# EAGLE design ecohydro-mega-shield (EAGLE 7.4.0)
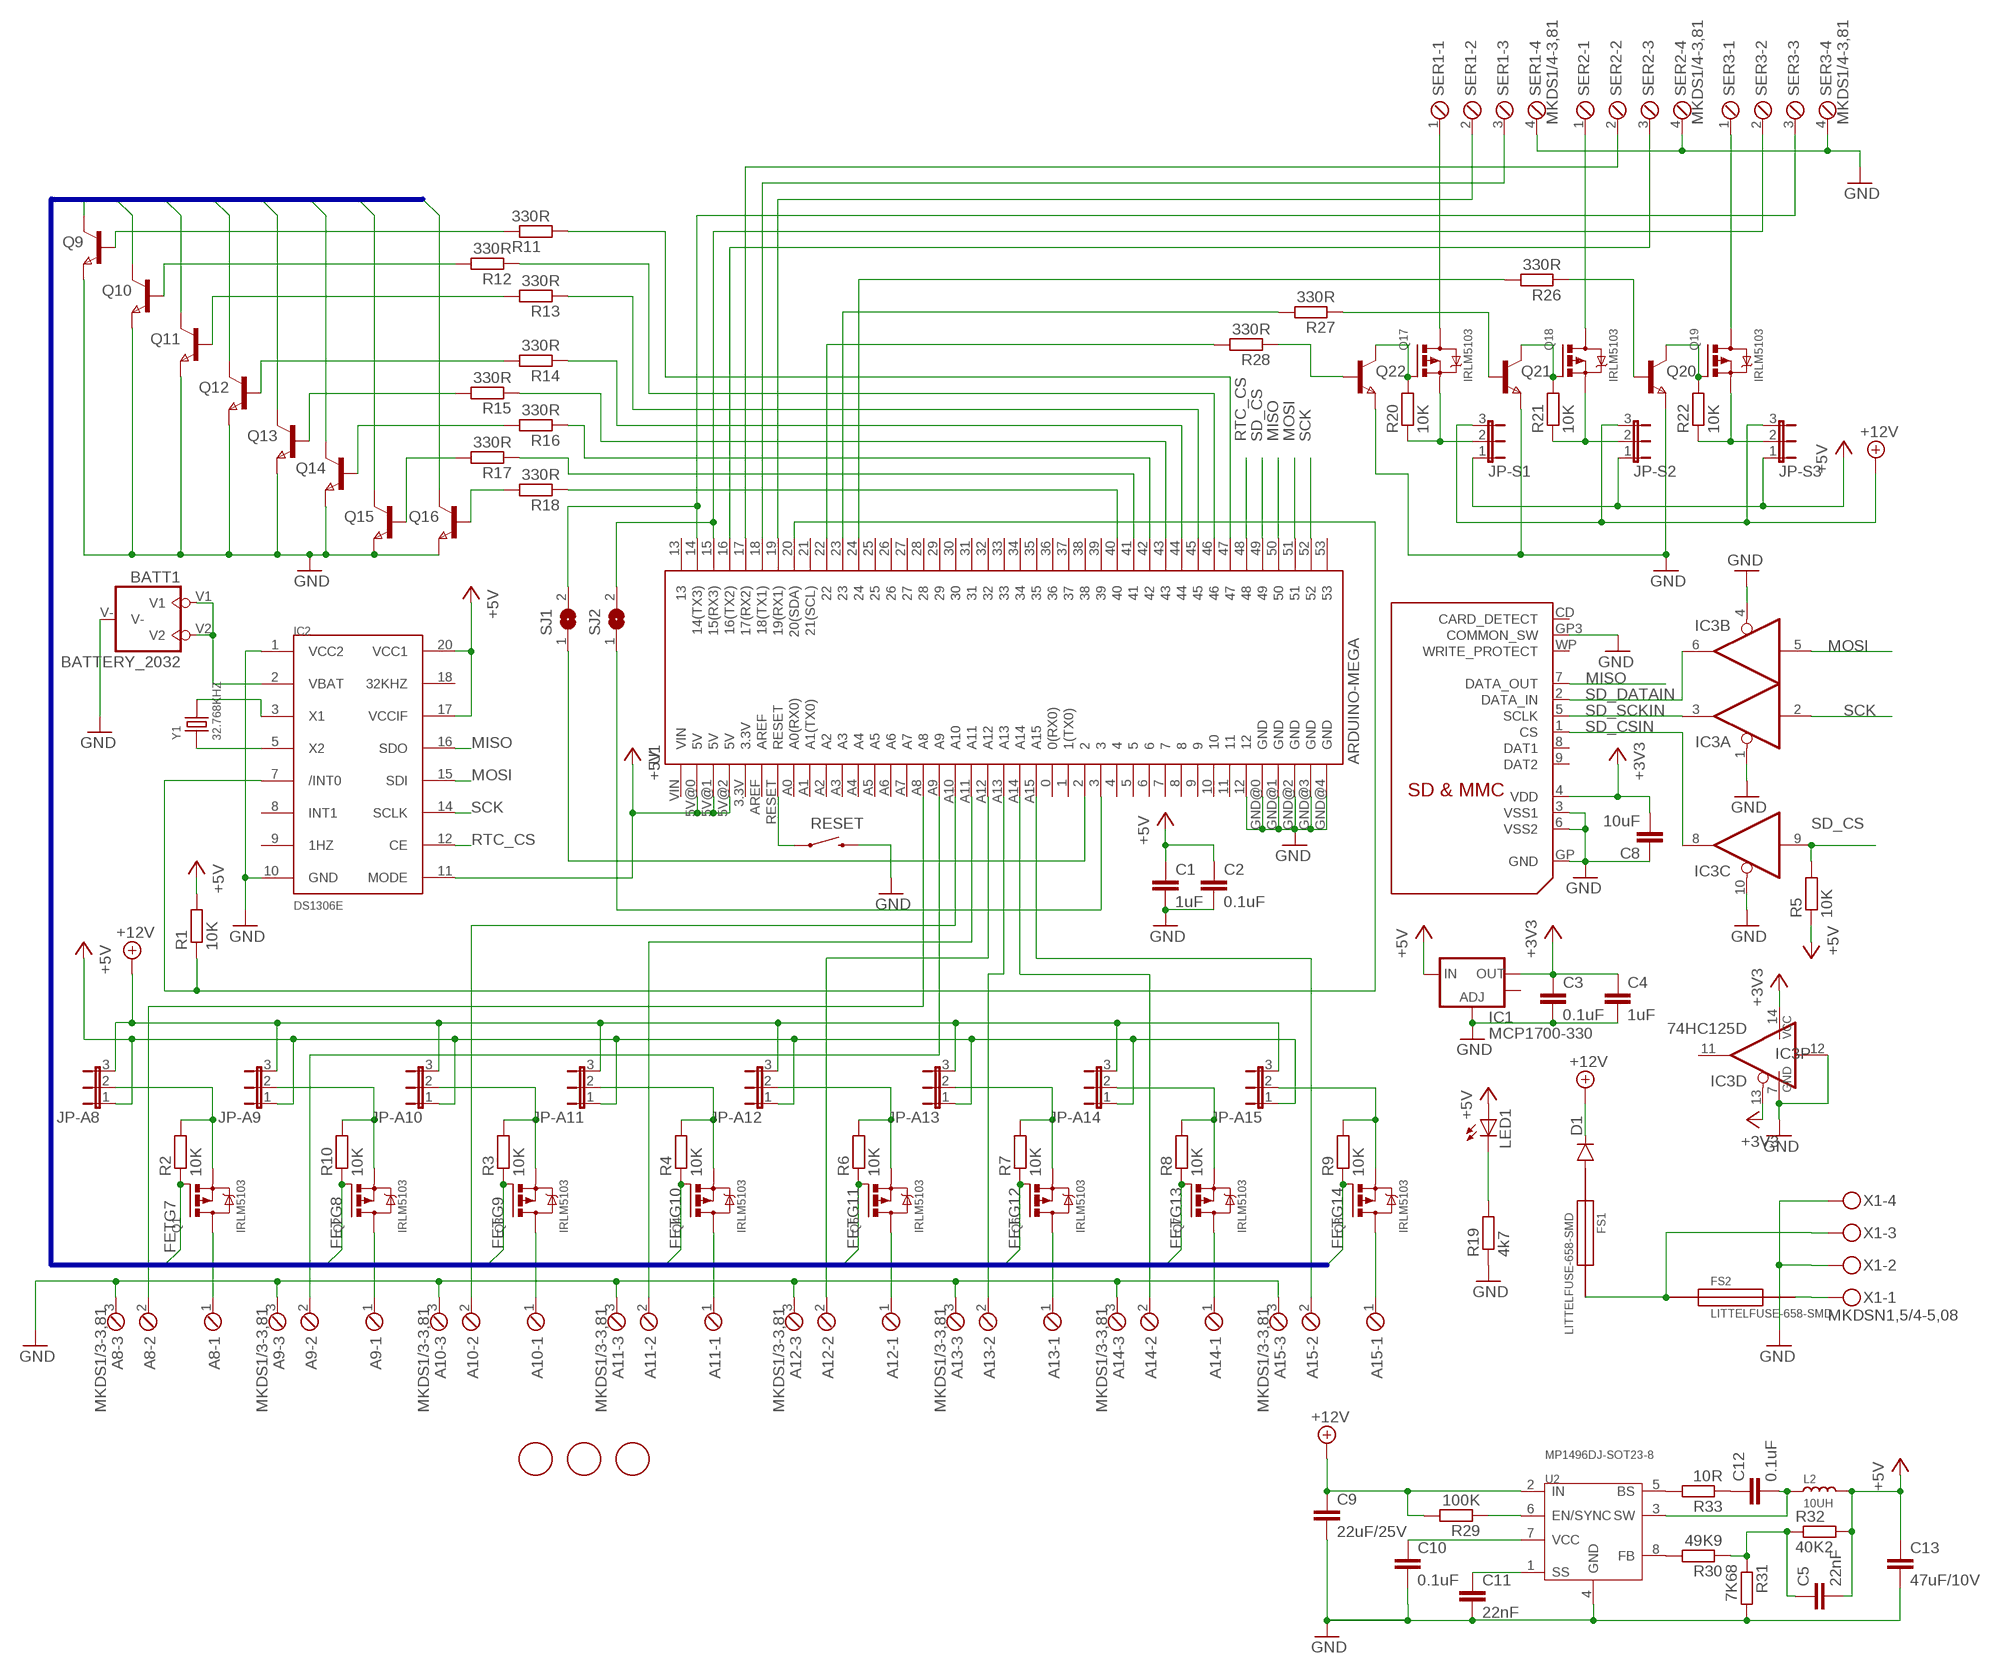
[diagram p0: schematic, sheet 1]

## Parts
A8  MKDS1/3-3,81  [3POL381]
A9  MKDS1/3-3,81  [3POL381]
A10  MKDS1/3-3,81  [3POL381]
A11  MKDS1/3-3,81  [3POL381]
A12  MKDS1/3-3,81  [3POL381]
A13  MKDS1/3-3,81  [3POL381]
A14  MKDS1/3-3,81  [3POL381]
A15  MKDS1/3-3,81  [3POL381]
BATT1  BATTERY_2032  [BATT2032]
C1  1uF  C-EUC0805K  [C0805K]
C2  0.1uF  C-EUC0805K  [C0805K]
C3  0.1uF  C-EUC0805K  [C0805K]
C4  1uF  C-EUC0805K  [C0805K]
C5  22nF  C-EUC0805K  [C0805K]
C8  10uF  C-EUC0805K  [C0805K]
C9  22uF/25V  C-EUC0805K  [C0805K]
C10  0.1uF  C-EUC0805K  [C0805K]
C11  22nF  C-EUC0805K  [C0805K]
C12  0.1uF  C-EUC0805K  [C0805K]
C13  47uF/10V  C-EUC0805K  [C0805K]
D1  DIODESMA  [SMA-DIODE]
FS1  LITTELFUSE-658-SMD  [LITTELFUSE-658-SMD]
FS2  LITTELFUSE-658-SMD  [LITTELFUSE-658-SMD]
IC1  MCP1700-330  V_REG_LM1117SOT223  [SOT223]
IC2  DS1306E  [SSOP20]
IC3  74HC125D  [SO14]
JP-A8  JP2E  [JP2]
JP-A9  JP2E  [JP2]
JP-A10  JP2E  [JP2]
JP-A11  JP2E  [JP2]
JP-A12  JP2E  [JP2]
JP-A13  JP2E  [JP2]
JP-A14  JP2E  [JP2]
JP-A15  JP2E  [JP2]
JP-S1  JP2E  [JP2]
JP-S2  JP2E  [JP2]
JP-S3  JP2E  [JP2]
L2  10UH  SMD-INDUCTOR-10UH-20%(2P-6X6MM)'0630'  [SMD-2P-L6.0XW6.0XH3.0MM]
LED1  LED1206  [LED-1206]
Q1  IRLM5103  [MICRO3]
Q2  IRLM5103  [MICRO3]
Q3  IRLM5103  [MICRO3]
Q4  IRLM5103  [MICRO3]
Q5  IRLM5103  [MICRO3]
Q6  IRLM5103  [MICRO3]
Q7  IRLM5103  [MICRO3]
Q8  IRLM5103  [MICRO3]
Q9  PBSS4021NT,215  [SOT23]
Q10  PBSS4021NT,215  [SOT23]
Q11  PBSS4021NT,215  [SOT23]
Q12  PBSS4021NT,215  [SOT23]
Q13  PBSS4021NT,215  [SOT23]
Q14  PBSS4021NT,215  [SOT23]
Q15  PBSS4021NT,215  [SOT23]
Q16  PBSS4021NT,215  [SOT23]
Q17  IRLM5103  [MICRO3]
Q18  IRLM5103  [MICRO3]
Q19  IRLM5103  [MICRO3]
Q20  PBSS4021NT,215  [SOT23]
Q21  PBSS4021NT,215  [SOT23]
Q22  PBSS4021NT,215  [SOT23]
R1  10K  R-EU_M0805  [M0805]
R2  10K  R-EU_M0805  [M0805]
R3  10K  R-EU_M0805  [M0805]
R4  10K  R-EU_M0805  [M0805]
R5  10K  R-EU_M0805  [M0805]
R6  10K  R-EU_M0805  [M0805]
R7  10K  R-EU_M0805  [M0805]
R8  10K  R-EU_M0805  [M0805]
R9  10K  R-EU_M0805  [M0805]
R10  10K  R-EU_M0805  [M0805]
R11  330R  R-EU_M0805  [M0805]
R12  330R  R-EU_M0805  [M0805]
R13  330R  R-EU_M0805  [M0805]
R14  330R  R-EU_M0805  [M0805]
R15  330R  R-EU_M0805  [M0805]
R16  330R  R-EU_M0805  [M0805]
R17  330R  R-EU_M0805  [M0805]
R18  330R  R-EU_M0805  [M0805]
R19  4k7  R-EU_R0805  [R0805]
R20  10K  R-EU_M0805  [M0805]
R21  10K  R-EU_M0805  [M0805]
R22  10K  R-EU_M0805  [M0805]
R26  330R  R-EU_M0805  [M0805]
R27  330R  R-EU_M0805  [M0805]
R28  330R  R-EU_M0805  [M0805]
R29  100K  R-EU_M0805  [M0805]
R30  49K9  R-EU_M0805  [M0805]
R31  7K68  R-EU_M0805  [M0805]
R32  40K2  R-EU_M0805  [M0805]
R33  10R  R-EU_M0805  [M0805]
RESET  SWITCH-MOMENTARY-2-SMD-1101NE  [TACTILE-SWITCH-1101NE]
SER1  MKDS1/4-3,81  [4POL381]
SER2  MKDS1/4-3,81  [4POL381]
SER3  MKDS1/4-3,81  [4POL381]
SJ1  SJ  [SJ]
SJ2  SJ  [SJ]
U1  ARDUINO-MEGA  [ARDUINO_MEGA_NOHOLES]
U2  MP1496DJ-SOT23-8  PMIC-MP1496DJ(SOT23-8)  [SOT-23-8]
U$1  SDMMC06132  [06132]
U$2  FIDUCIAL  [FIDUCIAL_1MM]
U$3  FIDUCIAL  [FIDUCIAL_1MM]
U$4  FIDUCIAL  [FIDUCIAL_1MM]
X1  MKDSN1,5/4-5,08  [MKDSN1,5/4-5,08]
Y1  32.768KHZ  SMD-CRYSTAL-32.768KHZ-12.5PF-20PPM-90K(2P-L2.0X1.2MM)  [X2-SMD-L2.0X1.2X0.55MM]

## Nets
+3V3: C3.1 C4.1 C8.2 IC1.2(OUT) IC3.13(D:OE) IC3.14(P:VCC) U$1.4(VDD)
+5V: C1.1 C2.1 C5.2 C13.1 IC1.3(IN) IC2.11(MODE) IC2.17(VCCIF) IC2.20(VCC1) JP-A8.1 JP-A9.1 JP-A10.1 JP-A11.1 JP-A12.1 JP-A13.1 JP-A14.1 JP-A15.1 JP-S1.1 JP-S2.1 JP-S3.1 L2.2 LED1.A R1.2 R5.1 R32.2 U1.5V@0(5V) U1.5V@1(5V) U1.5V@2(5V)
+12V: C9.1 D1.C JP-A8.3 JP-A9.3 JP-A10.3 JP-A11.3 JP-A12.3 JP-A13.3 JP-A14.3 JP-A15.3 JP-S1.3 JP-S2.3 JP-S3.3 R29.2 U2.2(IN)
+12VRAW: D1.A FS1.1
FETG7: Q1.1(G) Q16.3(C) R2.1
FETG8: Q2.1(G) Q15.3(C) R10.1
FETG9: Q3.1(G) Q14.3(C) R3.1
FETG10: Q4.1(G) Q13.3(C) R4.1
FETG11: Q5.1(G) Q12.3(C) R6.1
FETG12: Q6.1(G) Q11.3(C) R7.1
FETG13: Q7.1(G) Q10.3(C) R8.1
FETG14: Q8.1(G) Q9.3(C) R9.1
GND: A8.3 A9.3 A10.3 A11.3 A12.3 A13.3 A14.3 A15.3 BATT1.V- C1.2 C2.2 C3.2 C4.2 C8.1 C9.2 C10.2 C11.2 C13.2 IC1.1(ADJ) IC2.1(VCC2) IC2.10(GND) IC3.1(A:OE) IC3.4(B:OE) IC3.7(P:GND) IC3.10(C:OE) IC3.12(D:I) Q9.2(E) Q10.2(E) Q11.2(E) Q12.2(E) Q13.2(E) Q14.2(E) Q15.2(E) Q16.2(E) Q20.2(E) Q21.2(E) Q22.2(E) R19.1 R31.2 RESET.P$2 SER1.4 SER2.4 SER3.4 U1.12 U1.GND@0(GND) U1.GND@1(GND) U1.GND@2(GND) U1.GND@3(GND) U1.GND@4(GND) U2.4(GND) U$1.3(VSS1) U$1.6(VSS2) U$1.GP3(COMMON_SW) U$1.GP(GND) X1.2 X1.4
MISO: IC2.16(SDO) U1.50 U$1.7(DATA_OUT)
MOSI: IC2.15(SDI) IC3.5(B:I) U1.51
N$1: IC2.5(X2) Y1.1
N$2: RESET.P$1 U1.RESET
N$3: IC2.3(X1) Y1.2
N$4: A8.1 Q1.3(D)
N$5: A8.2 U1.A8
N$6: A9.1 Q2.3(D)
N$7: A9.2 U1.A9
N$8: A10.1 Q3.3(D)
N$9: A15.1 Q8.3(D)
N$10: A14.1 Q7.3(D)
N$11: A13.1 Q6.3(D)
N$12: A12.1 Q5.3(D)
N$13: A11.1 Q4.3(D)
N$14: IC2.7(/INT0) R1.1 U1.20(20(SDA))
N$15: BATT1.V1 BATT1.V2 IC2.2(VBAT)
N$16: JP-A8.2 Q1.2(S) R2.2
N$17: A10.2 U1.A10
N$18: A11.2 U1.A11
N$19: JP-A10.2 Q3.2(S) R3.2
N$20: A12.2 U1.A12
N$21: JP-A15.2 Q8.2(S) R9.2
N$22: JP-A14.2 Q7.2(S) R8.2
N$23: JP-A13.2 Q6.2(S) R7.2
N$24: JP-A12.2 Q5.2(S) R6.2
N$25: JP-A11.2 Q4.2(S) R4.2
N$26: JP-A9.2 Q2.2(S) R10.2
N$27: Q11.1(B) R13.2
N$28: Q12.1(B) R14.2
N$29: Q13.1(B) R15.2
N$30: A13.2 U1.A13
N$31: Q14.1(B) R16.2
N$32: Q15.1(B) R17.2
N$33: Q16.1(B) R18.2
N$34: Q9.1(B) R11.1
N$35: Q10.1(B) R12.2
N$36: R11.2 U1.47
N$37: R12.1 U1.46
N$38: R13.1 U1.45
N$39: R14.1 U1.44
N$40: R15.1 U1.43
N$41: R16.1 U1.42
N$42: R17.1 U1.41
N$43: R18.1 U1.40
N$44: FS1.2 FS2.1 X1.3
N$45: FS2.2 X1.1
N$46: SER1.3 U1.18(18(TX1))
N$47: SER1.2 U1.19(19(RX1))
N$48: SER2.2 U1.17(17(RX2))
N$49: SER2.3 U1.16(16(TX2))
N$50: SER3.2 SJ2.2 U1.15(15(RX3))
N$51: SER3.3 SJ1.2 U1.14(14(TX3))
N$52: LED1.C R19.2
N$53: Q17.3(D) SER1.1
N$54: Q18.3(D) SER2.1
N$55: Q19.3(D) SER3.1
N$56: Q17.1(G) Q22.3(C) R20.2
N$57: Q18.1(G) Q21.3(C) R21.2
N$58: Q19.1(G) Q20.3(C) R22.2
N$59: JP-S1.2 Q17.2(S) R20.1
N$60: JP-S2.2 Q18.2(S) R21.1
N$61: JP-S3.2 Q19.2(S) R22.1
N$65: Q20.1(B) R26.1
N$67: R26.2 U1.24
N$68: Q21.1(B) R27.1
N$69: R27.2 U1.23
N$70: Q22.1(B) R28.1
N$71: R28.2 U1.22
N$72: C10.1 U2.7(VCC)
N$73: SJ2.1 U1.3
N$74: R29.1 U2.6(EN/SYNC)
N$75: C11.1 U2.1(SS)
N$77: SJ1.1 U1.2
N$78: R30.2 U2.8(FB)
N$79: C5.1 R30.1 R31.1 R32.1
N$80: C12.2 L2.1 U2.3(SW)
N$82: R33.2 U2.5(BS)
N$83: C12.1 R33.1
N$87: A14.2 U1.A14
N$88: A15.2 U1.A15
RTC_CS: IC2.12(CE) U1.48
SCK: IC2.14(SCLK) IC3.2(A:I) U1.52
SD_CS: IC3.9(C:I) R5.2 U1.49
SD_CSIN: IC3.8(C:O) U$1.1(CS)
SD_DATAIN: IC3.6(B:O) U$1.2(DATA_IN)
SD_SCKIN: IC3.3(A:O) U$1.5(SCLK)
Unconnected: IC1.4(OUT) IC2.8(INT1) IC2.9(1HZ) IC2.18(32KHZ) IC3.11(D:O) U1.0(0(RX0)) U1.1(1(TX0)) U1.3.3V U1.4 U1.5 U1.6 U1.7 U1.8 U1.9 U1.10 U1.11 U1.13 U1.21(21(SCL)) U1.25 U1.26 U1.27 U1.28 U1.29 U1.30 U1.31 U1.32 U1.33 U1.34 U1.35 U1.36 U1.37 U1.38 U1.39 U1.53 U1.A0(A0(RX0)) U1.A1(A1(TX0)) U1.A2 U1.A3 U1.A4 U1.A5 U1.A6 U1.A7 U1.AREF U1.VIN U$1.8(DAT1) U$1.9(DAT2) U$1.CD(CARD_DETECT) U$1.WP(WRITE_PROTECT)

## Buses
FETG[7..14]

## Library data of the parts
A8-A15 = con-phoenix-381:MKDS1/3-3,81: MKDS 1/3-3,81 - Order No. 1727023 (RS-Online - 101-5390) Pitch: 3,81mm Number of terminals: 3 Rated Voltage: 160V Maximum load current/ cross section: 12A/1.5mm2-AWG16 Housing Interlocking: none Color: Green
BATT1 = mechanical:BATTERY_2032: BATTERY; DIGIKEY: BK-883CT-ND
C1-C5 C8 C10-C12 = rcl:C-EU: CAPACITOR, European symbol
C9 = rcl:C-EU: CAPACITOR, European symbol; DIGIKEY: 1276-2891-1-ND
C13 = rcl:C-EU: CAPACITOR, European symbol; DIGIKEY: 709-1231-1-ND
D1 = SparkFun-DiscreteSemi:DIODE: Diode These are standard reverse protection diodes and small signal diodes. SMA package can handle up to about 1A. SOD-323 can handle about 200mA. What the SOD-323 package when ordering, there are some mfgs out there that are 5-pin packages.; DIGIKEY: S1GFSCT-ND; MOUSER: 625-RS1A-E3/5AT
FS1 FS2 = mechanical:LITTELFUSE-658-SMD; MOUSER: 576-65800001109
IC1 = SparkFun-PowerIC:V_REG_LM1117: Voltage Regulator LM1117 Standard adjustable voltage regulator but in SMD form. Spark Fun Electronics SKU : COM-00595; DIGIKEY: AP1117IE33G-13DITR-ND
IC2 = semiconductors:DS1306: Serial Alarm Real-Time Clock; DIGIKEY: DS1306EN+T&RCT-ND
IC3 = 74xx-eu:74*125: Quad bus BUFFER, 3-state; DIGIKEY: 568-1392-2-ND
JP-A8-JP-A15 JP-S1-JP-S3 = jumper:JP2E: JUMPER
L2 = Seeed-Inductor-2016:SMD-INDUCTOR-10UH-20%(2P-6X6MM): 303010016; DIGIKEY: 732-5536-1-ND; MPN: CSAB0630-100M
LED1 = semiconductors:LED: Light Emitting Diode
Q1-Q8 Q17-Q19 = semiconductors:IRLM5103: HEXFET P-Channel Power MOSFET; MOUSER: 942-IRLML5103TRPBF
Q9-Q16 Q20-Q22 = semiconductors:PBSS4021NT,215; DIGIKEY: PBSS4021NT,215
R1-R10 R20-R22 R26-R29 = rcl:R-EU_: RESISTOR, European symbol
R11-R18 = rcl:R-EU_: RESISTOR, European symbol; DIGIKEY: 541-330ACT-ND
R19 = passives:R-EU_: RESISTOR, European symbol
R30-R33 = rcl:R-EU_: RESISTOR, European symbol; DIGIKEY: 541-49.9KCCT-ND
RESET = SparkFun-Electromechanical:SWITCH-MOMENTARY-2: Various NO switches- pushbuttons, reed, etc
SER1-SER3 = con-phoenix-381:MKDS1/4-3,81: MKDS 1/4-3,81 - Order No. 1727036 Pitch: 3,81mm Number of terminals: 4 Rated Voltage: 160V Maximum load current/ cross section: 12A/1.5mm2-AWG16 Housing Interlocking: none Color: Green
SJ1 SJ2 = jumper:SJ: SMD solder JUMPER
U1 = mechanical:ARDUINO-MEGA: Arduino Mega board footprint
U2 = Seeed-IC-2016:PMIC-MP1496DJ(SOT23-8): 310030121; MPN: MP1496DJ
U$1 = adafruit:SDMMC: SD MMC Card holder 4UCON part #06132 - easy to solder
U$2-U$4 = adafruit:FIDUCIAL: For use by pick and place machines to calibrate the vision/machine, 1mm By microbuilder.eu
X1 = mechanical:MKDSN1,5/4-5,08: MKDSN 1,5/ 4-5,08 Printklemme Nennstrom: 13,5 A Nennspannung: 250 V Rastermaß: 5,08 mm Polzahl: 4 Anschlussart: Schraubanschluss Montage: Löten Anschlussrichtung Leiter/Platine: 0 ° Artikelnummer: 1729144 Source: http://eshop.phoenixcontact.com .. 1729144.pdf
Y1 = Seeed-Crystal Oscillator-2016:SMD-CRYSTAL-32.768KHZ-12.5PF-20PPM-90K(2P-L2.0X1.2MM): 306010020; DIGIKEY: 535-12051-1-ND; MPN: FC-12M; VALUE: 3.2768KHZ

## Board
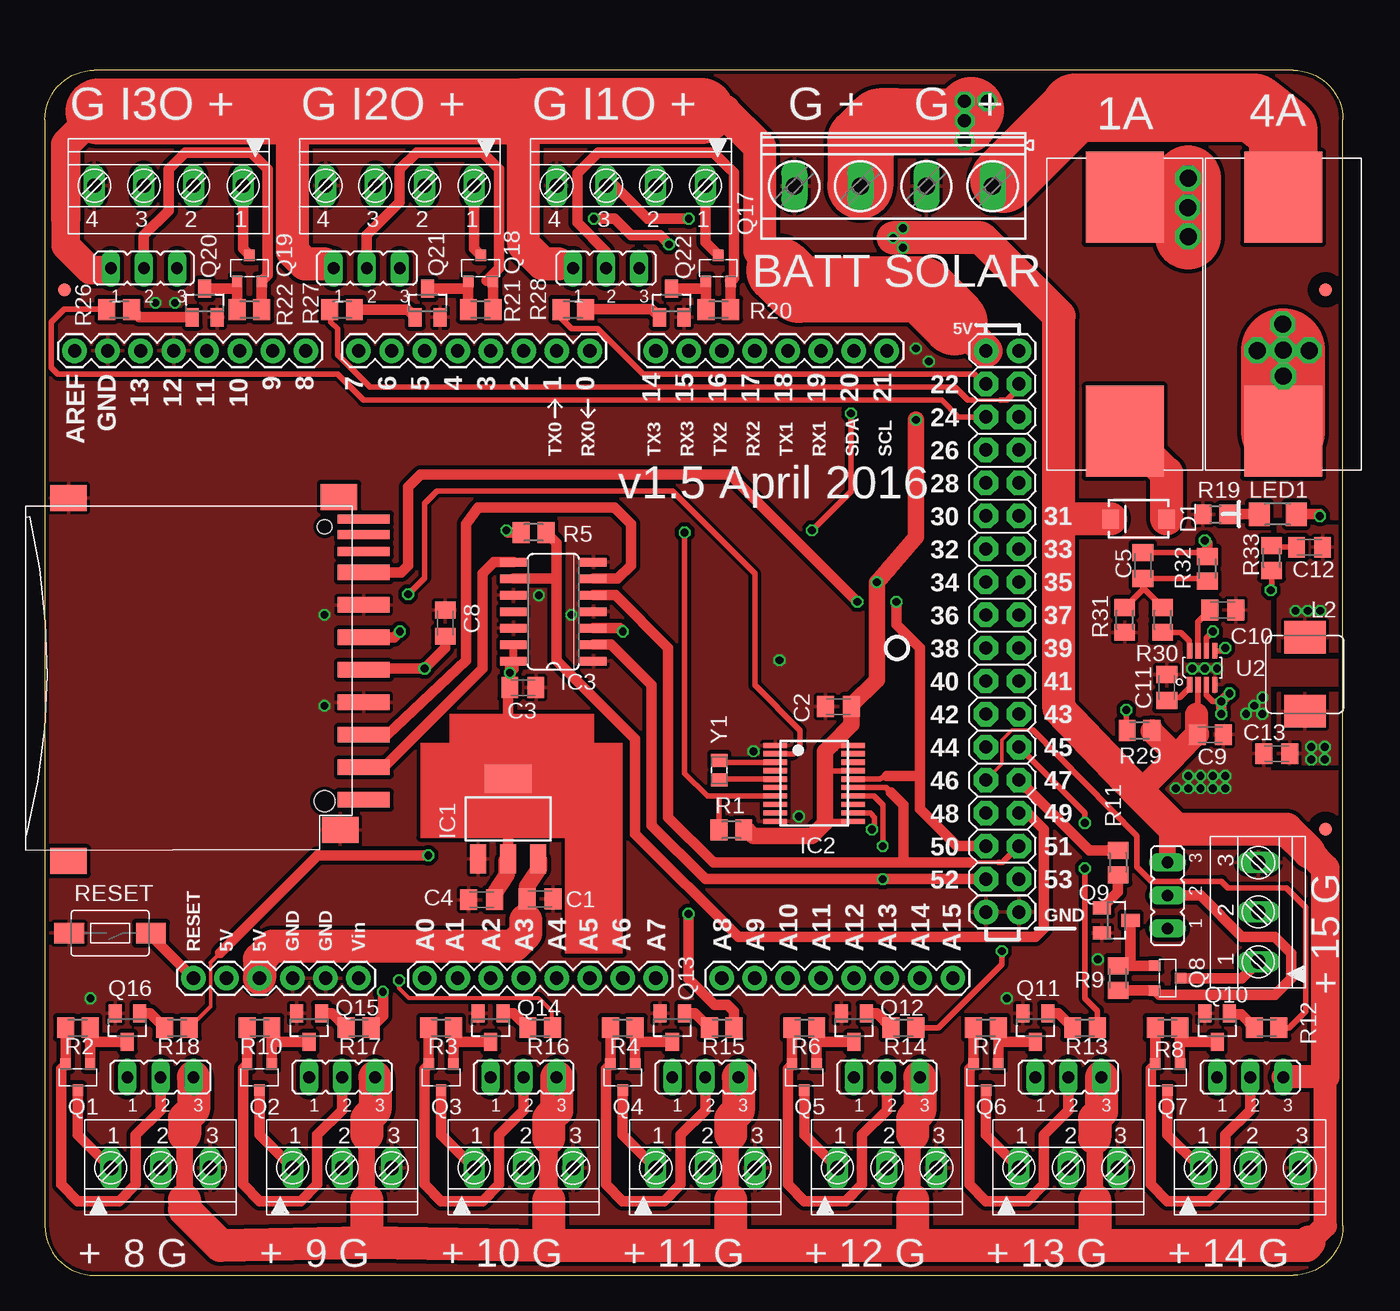
[diagram p1: board, top side]
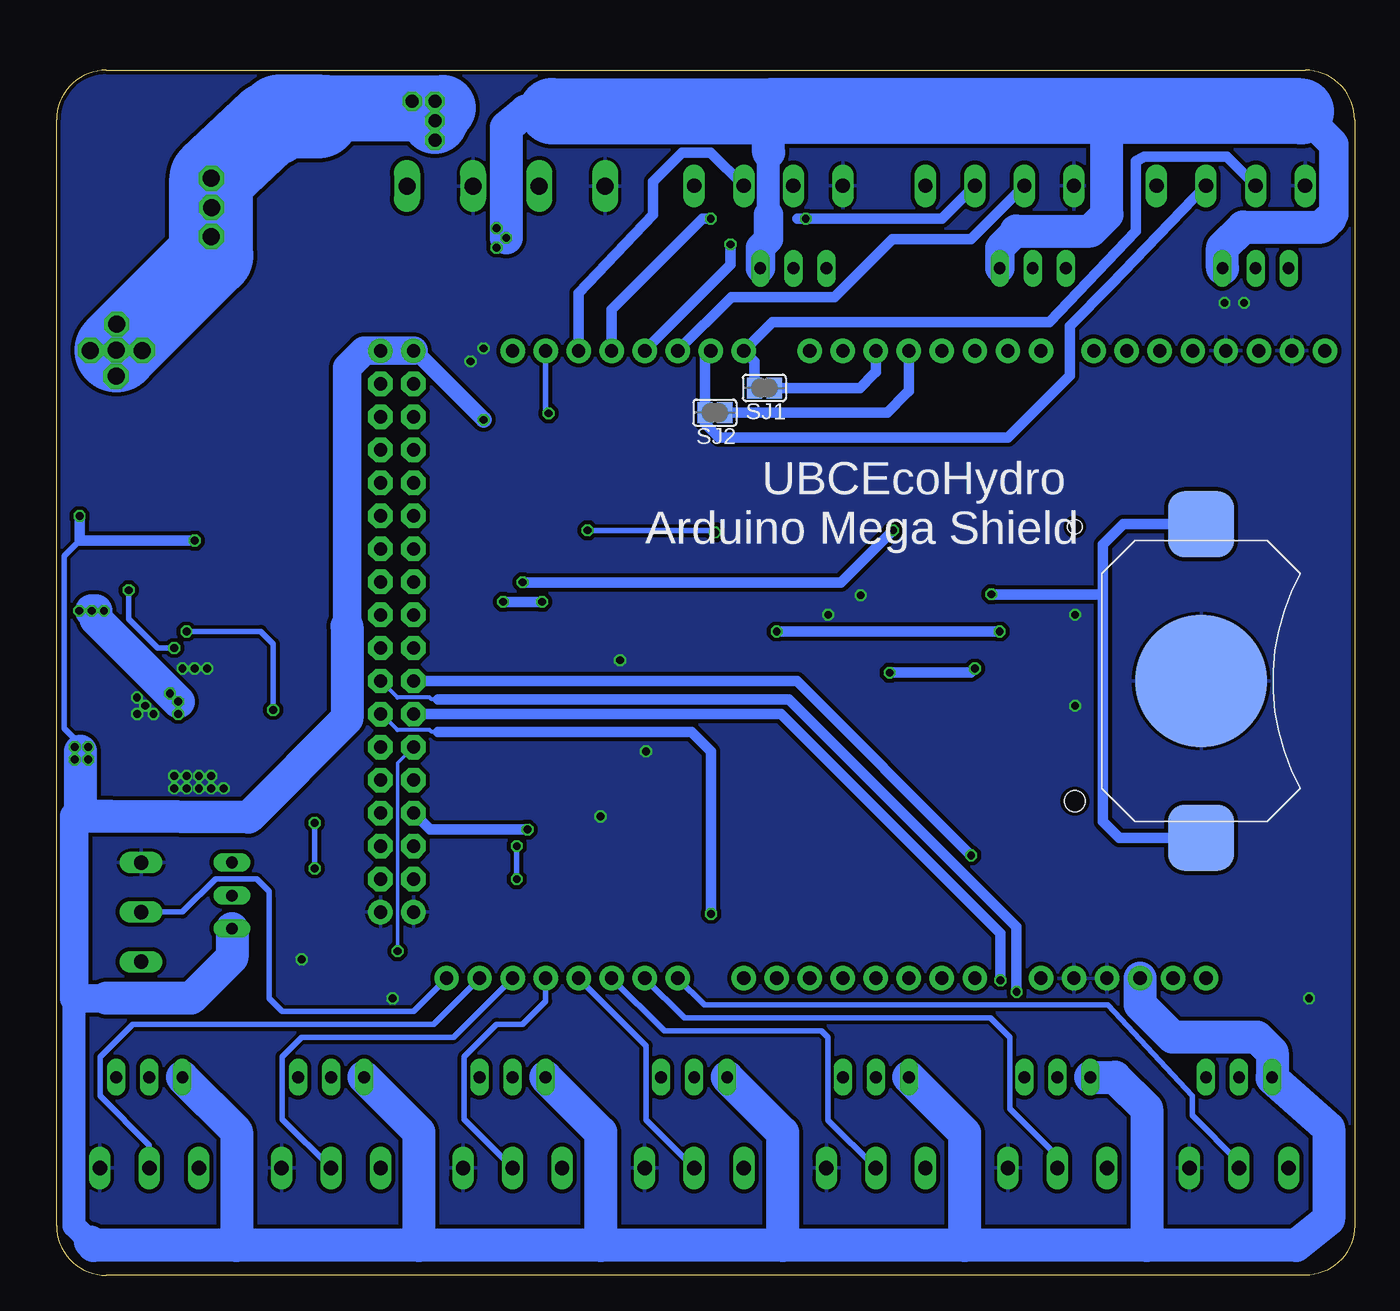
[diagram p2: board, bottom side, seen from below]

Size 99.85 x 92.71 mm. Coordinates in mm from the lower left corner, seen from the top.
Outline: 3.81,0 96.04,0 arc90 99.85,3.81 99.85,88.9 arc90 96.04,92.71 3.81,92.71 arc90 0,88.9 0,3.81 arc90 3.81,0
Copper layers (1*16): Top 0.035mm / dielectric 1.5mm / Bottom 0.035mm
Design rules "SeeedStudio_2layer_DRU_no_angle_20140221": minimum track width 6mil, minimum drill 12mil, track to track 6mil, track to pad 6mil, pad to pad 6mil, via to via 6mil, smd to smd 0mil, copper to edge 10mil, drill to drill 10mil, minimum pad ring 10mil, minimum via ring 6mil, stop-mask expansion 2mil, vias tented up to drill 100mil, thermal gap 10mil

### Footprints (pad centres in the part's own frame; a part is rotated, then mirrored left to right if it is on the bottom)
3POL381 = drill 1.1 long: 1 0,0; 2 3.81,0; 3 7.62,0
BATT2032 = smd 5.08 x 5.08: V1 -12.065,0; V2 12.065,0 | smd 10.16 x 10.16: V- 0,0
C0805K = smd 1.3 x 1.6: 1 -1,0; 2 1,0
SMA-DIODE = smd 1.27 x 1.47: A -2.15,0; C 2.15,0
LITTELFUSE-658-SMD = smd 7 x 6: 1 -9,0; 2 9,0
SOT223 = smd 1.219 x 2.235: 1 -2.311,-3.099; 2 0,-3.099; 3 2.311,-3.099 | smd 3.6 x 2.2: 4 0,3.099
SSOP20 = smd 0.4 x 1.8: 1 -2.925,-3; 2 -2.275,-3; 3 -1.625,-3; 4 -0.975,-3; 5 -0.325,-3; 6 0.325,-3; 7 0.975,-3; 8 1.625,-3; 9 2.275,-3; 10 2.925,-3; 11 2.925,3; 12 2.275,3; 13 1.625,3; 14 0.975,3; 15 0.325,3; 16 -0.325,3; 17 -0.975,3; 18 -1.625,3; 19 -2.275,3; 20 -2.925,3
SO14 = smd 0.66 x 2.032: 1 -3.81,-3.073; 2 -2.54,-3.073; 3 -1.27,-3.073; 4 0,-3.073; 5 1.27,-3.073; 6 2.54,-3.073; 7 3.81,-3.073; 8 3.81,3.073; 9 2.54,3.073; 10 1.27,3.073; 11 0,3.073; 12 -1.27,3.073; 13 -2.54,3.073; 14 -3.81,3.073
JP2 = drill 0.914 long: 1 -2.54,0; 2 0,0; 3 2.54,0
SMD-2P-L6.0XW6.0XH3.0MM = smd 2.5 x 3.2: 1 -2.85,0; 2 2.85,0
LED-1206 = smd 1.6 x 1.803: A 1.422,0; C -1.422,0
MICRO3 = smd 0.8 x 0.9: 1 -0.95,-1; 2 0.95,-1; 3 0,1
SOT23 = smd 1 x 1.4: 1 -0.95,-1.1; 2 0.95,-1.1; 3 0,1.1
M0805 = smd 1.3 x 1.6: 1 -0.95,0; 2 0.95,0
R0805 = smd 1.3 x 1.5: 1 -0.95,0; 2 0.95,0
TACTILE-SWITCH-1101NE = smd 2.3 x 1.6: P$1 -3.15,0; P$2 3.15,0
4POL381 = drill 1.1 long: 1 0,0; 2 3.81,0; 3 7.62,0; 4 11.43,0
SJ = smd 1.168 x 1.6: 1 -0.762,0; 2 0.762,0
ARDUINO_MEGA_NOHOLES = drill 1.016 pad 1.88: 0 63.5,50.8; 1 60.96,50.8; 2 58.42,50.8; 3 55.88,50.8; 3.3V 35.56,2.54; 4 53.34,50.8; 5 50.8,50.8; 5V@0 38.1,2.54; 5V@1 93.98,50.8; 5V@2 96.52,50.8; 6 48.26,50.8; 7 45.72,50.8; 8 41.656,50.8; 9 39.116,50.8; 10 36.576,50.8; 11 34.036,50.8; 12 31.496,50.8; 13 28.956,50.8; 14 68.58,50.8; 15 71.12,50.8; 16 73.66,50.8; 17 76.2,50.8; 18 78.74,50.8; 19 81.28,50.8; 20 83.82,50.8; 21 86.36,50.8; A0 50.8,2.54; A1 53.34,2.54; A2 55.88,2.54; A3 58.42,2.54; A4 60.96,2.54; A5 63.5,2.54; A6 66.04,2.54; A7 68.58,2.54; A8 73.66,2.54; A9 76.2,2.54; A10 78.74,2.54; A11 81.28,2.54; A12 83.82,2.54; A13 86.36,2.54; A14 88.9,2.54; A15 91.44,2.54; AREF 23.876,50.8; GND@0 40.64,2.54; GND@1 43.18,2.54; GND@2 93.98,7.62; GND@3 96.52,7.62; GND@4 26.416,50.8; RESET 33.02,2.54; VIN 45.72,2.54 | drill 1.016 pad 1.88 octagon: 22 93.98,48.26; 23 96.52,48.26; 24 93.98,45.72; 25 96.52,45.72; 26 93.98,43.18; 27 96.52,43.18; 28 93.98,40.64; 29 96.52,40.64; 30 93.98,38.1; 31 96.52,38.1; 32 93.98,35.56; 33 96.52,35.56; 34 93.98,33.02; 35 96.52,33.02; 36 93.98,30.48; 37 96.52,30.48; 38 93.98,27.94; 39 96.52,27.94; 40 93.98,25.4; 41 96.52,25.4; 42 93.98,22.86; 43 96.52,22.86; 44 93.98,20.32; 45 96.52,20.32; 46 93.98,17.78; 47 96.52,17.78; 48 93.98,15.24; 49 96.52,15.24; 50 93.98,12.7; 51 96.52,12.7; 52 93.98,10.16; 53 96.52,10.16
SOT-23-8 = smd 0.4 x 1.2: 1 -0.975,-1.3; 2 -0.325,-1.3; 3 0.325,-1.3; 4 0.975,-1.3; 5 0.975,1.3; 6 0.325,1.3; 7 -0.325,1.3; 8 -0.975,1.3
06132 = smd 1.2 x 4: 1 6.9,0.9; 2 4.4,0.9; 3 1.9,0.9; 4 -0.6,0.9; 5 -3.1,0.9; 6 -5.6,0.9; 7 -8.1,0.9; 9 9.4,0.9 | smd 0.7 x 4: 8 -9.7,0.9; CD -11,0.9; WP -12.2,0.9 | smd 2 x 2.8: GP -13.8,-21.8; GP2 14.1,-21.8; GP3 11.7,-0.9; GP4 -13.9,-1 | hole 1.1: -11.6,-2.1 | hole 1.6: 9.5,-2.1
FIDUCIAL_1MM = smd 1 x 1: 1 0,0
MKDSN1,5/4-5,08 = drill 1.3 pad 2 long: 1 -7.641,0.025; 2 -2.561,0.025; 3 2.519,0.025; 4 7.599,0.025
X2-SMD-L2.0X1.2X0.55MM = smd 1 x 1.25: 1 -0.75,0; 2 0.75,0

### Placement (x,y rotation side)
A8  5.08,8.26 0 top
A9  19.05,8.26 0 top
A10  33.02,8.26 0 top
A11  46.99,8.26 0 top
A12  60.96,8.26 0 top
A13  74.93,8.26 0 top
A14  88.9,8.26 0 top
A15  93.34,24.13 90 top
BATT1  11.81,45.72 90 bottom
C1  38.09,28.96 0 top
C2  61.06,43.75 180 top
C3  36.77,45.21 0 top
C4  33.58,28.89 180 top
C5  84.45,54.61 90 top
C8  30.8,50.16 270 top
C9  89.66,41.59 0 top
C10  90.61,51.18 0 top
C11  86.3,45.21 90 top
C12  97.28,56.01 0 top
C13  94.76,40.13 180 top
D1  84.13,58.19 180 top
FS1  83.07,73.93 90 top
FS2  95.25,73.93 90 top
IC1  35.62,35.12 0 top
IC2  59.18,37.85 270 top
IC3  39.12,51.05 90 top
JP-A8  8.89,15.24 0 top
JP-A9  22.86,15.24 0 top
JP-A10  36.83,15.24 0 top
JP-A11  50.8,15.24 0 top
JP-A12  64.77,15.24 0 top
JP-A13  78.74,15.24 0 top
JP-A14  92.71,15.24 0 top
JP-A15  86.36,29.21 90 top
JP-S1  43.18,77.47 0 top
JP-S2  24.77,77.47 0 top
JP-S3  7.62,77.47 0 top
L2  96.92,46.23 270 top
LED1  94.84,58.55 0 top
Q1  2.54,15.24 180 top
Q2  16.51,15.24 180 top
Q3  30.48,15.24 180 top
Q4  44.45,15.24 180 top
Q5  58.42,15.24 180 top
Q6  72.39,15.24 180 top
Q7  86.36,15.24 180 top
Q8  86.36,22.86 270 top
Q9  82.42,27.3 270 top
Q10  90.17,19.05 180 top
Q11  76.2,19.05 180 top
Q12  62.23,19.05 180 top
Q13  48.26,19.05 180 top
Q14  34.29,19.05 180 top
Q15  20.32,19.05 180 top
Q16  6.35,19.05 180 top
Q17  51.8,77.47 0 top
Q18  33.52,77.47 0 top
Q19  15.74,77.47 0 top
Q20  12.29,74.8 0 top
Q21  29.44,74.8 0 top
Q22  48.22,74.8 0 top
R1  52.81,34.27 0 top
R2  2.54,19.05 180 top
R3  30.48,19.05 180 top
R4  44.45,19.05 180 top
R5  37.59,57.15 0 top
R6  58.42,19.05 180 top
R7  72.39,19.05 180 top
R8  86.36,19.05 180 top
R9  82.55,22.86 270 top
R10  16.51,19.05 180 top
R11  82.55,31.75 90 top
R12  93.98,19.05 180 top
R13  80.01,19.05 180 top
R14  66.04,19.05 180 top
R15  52.07,19.05 180 top
R16  38.1,19.05 180 top
R17  24.13,19.05 180 top
R18  10.16,19.05 180 top
R19  90.03,58.54 0 top
R20  51.8,74.3 180 top
R21  33.52,74.3 180 top
R22  15.74,74.3 180 top
R26  5.71,74.3 180 top
R27  22.86,74.3 180 top
R28  40.64,74.3 180 top
R29  84.2,41.91 0 top
R30  85.98,50.42 270 top
R31  83.06,50.42 270 top
R32  89.41,54.36 90 top
R33  94.36,55.18 270 top
RESET  5.01,26.33 180 top
SER1  50.8,83.82 180 top
SER2  33.02,83.82 180 top
SER3  15.24,83.82 180 top
SJ1  45.4,68.26 180 bottom
SJ2  49.21,66.36 180 bottom
U1  -21.59,20.32 0 top
U2  89.03,46.74 0 top
U$1  23.62,45.97 270 top
U$2  1.5,75.81 0 top
U$3  98.5,75.81 0 top
U$4  98.5,34.31 0 top
X1  65.25,83.81 180 top
Y1  51.88,38.86 90 top

### Tracks (layer width: path | path; a pad name or v marks a point on that pad's centre or on a via)
+3V3  (via drill 0.6)
  Top 0.61: IC3.14 IC3.13
  Top 0.813: C3.1 v35.77,46.36 | v35.77,46.36 35.77,46.97 IC3.14 36.04,46.63 v35.77,46.36 | IC1.2 35.62,45.07 C3.1 | C3.1 35.75,45.53 | U$1.4 24.62,46.67 v29.21,46.67 30.8,48.26 C8.2
  Top 1.27: IC1.2 35.5,31.89 35.5,30.81 34.58,29.39 C4.1
  Bottom 0.813: v35.77,46.36 29.53,46.36 v29.21,46.67
+5V  (via drill 0.6)
  Top 0.406: IC2.17 60,38.81 | IC2.20 60.54,40.77 60.5,40.81 | IC2.11 60.11,34.92 60,34.81 | R32.2 89.1,55.61 C5.2
  Top 0.813: R5.1 35.66,57.15 arc-90 v35.5,57.31 | 64.92,54.23 64.92,54.38 | 4.5,77.31 4.66,77.47 JP-S3.1 | R32.2 89.41,56.32 v89.22,56.52 | v98.08,58.4 98.08,58.55 LED1.A
  Top 1.27: IC1.3 38,31.95 38,31.31 37.09,29.9 C1.1 37.09,27.4 37,27.31 | v67,65.81 67,56.81 64.92,54.38 v64,53.31 64,45.81 62.06,43.87 C2.1 62.06,42.37 60.5,40.81 60,40.31 60,38.81 60,34.81 59,33.81 54.5,33.81 54.04,34.27 R1.2 | 21.5,77.81 21.84,77.47 JP-S2.1 | 39.5,77.81 39.84,77.47 JP-S1.1
  Top 2.184: 1.59,81.28 1.59,79.22 3.5,77.31 4.5,77.31
  Top 2.286: 4.13,89.53 1.59,87 1.59,81.28
  Top 2.54: 19.05,89.53 19.05,78.76 20,77.81 21.5,77.81 | 36.83,89.53 36.83,79.28 38.3,77.81 39.5,77.81 | U1.5V@0 16.51,24.32 17.5,25.31 36,25.31 37,26.31 37,27.31 | U1.5V@1 70.2,73.31 70,73.31 | 56.5,77.31 55,78.81 55,86.81 52.25,89.56 50.5,89.56
  Top 5.08: 4.13,89.53 19.05,89.53 36.83,89.53 36.85,89.56 50.5,89.56 | 70,73.31 67.5,75.81 58,75.81 56.5,77.31
  Bottom 0.406: 99,40.57 98.93,40.64 v98.44,40.64 | v98.44,40.64 98.44,41.26 99.25,42.06 99.25,55.34 98.08,56.52 | v98.44,40.64 98.33,40.64 98,40.31
  Bottom 0.813: v35.5,57.31 39.5,53.31 v64,53.31 | v89.22,56.52 98,56.52 98.08,56.52 v98.08,58.4
  Bottom 1.27: v67,65.81 72.31,71.12 U1.5V@1 | 98.5,35.36 97.5,35.36 97.5,35.31
  Bottom 1.778: 97.25,2.56 98.5,3.81 98.5,21.31
  Bottom 2.184: 96,21.31 98.5,21.31 98.5,35.36 | U1.5V@0 16.46,22.81 | 77.5,49.93 77.5,69.81 76.19,71.12 U1.5V@2 U1.5V@1
  Bottom 2.54: 16,2.31 4.5,2.31 2,4.31 2,11.31 6.35,15.16 JP-A8.1 6.35,17.16 7.5,18.31 14,18.31 16.5,20.81 U1.5V@0 | 16,2.31 30,2.31 | 30,2.31 44,2.31 | 44,2.31 58,2.31 | 58,2.31 72,2.31 | 72,2.31 86,2.31 | 86,2.31 97,2.31 97.25,2.56 | JP-A9.1 18.43,15.24 16,12.81 16,2.31 | JP-A10.1 30,10.95 30,2.31 | JP-A11.1 44,10.98 44,2.31 | JP-A12.1 58,11.01 58,2.31 | JP-A13.1 72,11.04 72,2.31 | JP-A14.1 86,11.07 86,2.31 | JP-A15.1 86.36,24.45 89.5,21.31 96,21.31 | 77.5,49.93 77.5,42.83 85.09,35.24 95.75,35.31 97.5,35.31 98,35.31 98,35.36 98,40.31
  other vias: 97.42,40.64 98.44,39.69 97.42,39.69
  pour Top (isolate 0.305): 100.03,39.37 100.03,44.77 94.89,44.77 94.89,39.37
+12V  (via drill 0.6)
  Top 0.305: v65.25,79.81 v66,79.06
  Top 0.406: U2.2 88.7,43.3 88.58,43.18
  Top 1.27: 10.75,10.81 10.75,5.81 | 24.75,10.81 24.75,5.81 | 52.75,10.81 52.75,5.81 | 66.75,10.81 66.75,5.81 | 80.75,10.56 80.75,5.81 | JP-A15.3 86.36,34.17 87.5,34.31 | 88.58,41.99 C9.1
  Top 1.422: 38.75,10.56 38.75,5.81
  Top 1.778: 97.25,2.56 98.5,3.81 98.5,15.31 95.32,15.31 JP-A14.3 | 88.58,43.18 88.58,41.99 | C9.1 88.66,41.67 87,40.01 | 87,40.01 84.15,37.16 | R29.2 85.15,41.85 87,40.01
  Top 2.184: 98.5,15.31 98.5,31.31 97.25,32.56
  Top 2.54: JP-A8.3 11.43,12.74 10.75,12.06 10.75,10.81 | 10.75,5.81 10.75,5.06 13.5,2.31 24.75,2.56 | 24.75,2.56 38.75,2.31 | 38.75,2.31 52.75,2.31 | 52.75,2.31 66.5,2.31 | 66.5,2.31 80.75,2.31 | 80.75,2.31 97,2.31 97.25,2.56 | JP-A9.3 25.4,12.71 24.75,12.06 24.75,10.81 | 24.75,5.81 24.75,2.56 | JP-A10.3 39.37,12.68 38.75,12.06 38.75,10.56 | 38.75,5.81 38.75,2.31 | JP-A11.3 53.34,12.65 52.75,12.06 52.75,10.81 | 52.75,5.81 52.75,2.31 | JP-A12.3 67.31,12.62 66.75,12.06 66.75,10.81 | 66.75,5.81 66.75,2.81 66.5,2.31 | JP-A13.3 81.28,12.59 80.75,12.06 80.75,10.56 | 80.75,5.81 80.75,2.31 | 97.25,32.56 95.5,34.31 87.5,34.31 87,34.31 84.15,37.16 78,43.56 78,58.04 78,58.56 | 78,58.56 78,73.81 72,79.81 v65.25,79.81 | D1.C 78.37,58.19 78,58.56
  Bottom 0.406: v65.25,79.81 66,79.81 v66,80.56
  Bottom 1.778: 45.09,81.6 45.09,86.36
  Bottom 2.286: 1.91,81.28 1.59,81.6 1.59,87 4.13,89.53 | JP-S2.3 27.3,79.06 26.04,80.33 | JP-S1.3 45.72,79.06 45.09,79.69 45.09,81.6
  Bottom 2.54: JP-S3.3 10.16,79.06 8.57,80.64 2.54,80.64 1.91,81.28 | 26.04,80.33 20.32,80.33 19.05,81.6 19.05,89.53 | 45.09,86.36 45.09,89.53 | v65.25,79.81 65.25,88.31 63.75,89.56 61.75,89.56
  Bottom 5.08: 4.13,89.53 19.05,89.53 45.09,89.53 61.73,89.53 61.75,89.56
+12VRAW
  Top 2.54: FS1.1 86.28,61.72 D1.A
FETG7
  Top 0.813: Q1.1 3.49,17.81 | 3.49,17.81 R2.1 | Q16.3 3.63,17.95 3.49,17.81
FETG8
  Top 0.813: Q2.1 17.46,17.81 | 17.46,17.81 R10.1 | Q15.3 17.6,17.95 17.46,17.81
FETG9
  Top 0.813: Q3.1 31.43,17.81 | 31.43,17.81 R3.1 | Q14.3 31.57,17.95 31.43,17.81
FETG10
  Top 0.813: Q4.1 45.4,17.81 | 45.4,17.81 R4.1 | Q13.3 45.54,17.95 45.4,17.81
FETG11
  Top 0.813: Q5.1 59.37,17.81 | 59.37,17.81 R6.1 | Q12.3 59.51,17.95 59.37,17.81
FETG12
  Top 0.813: Q6.1 73.34,17.81 | 73.34,17.81 R7.1 | Q11.3 73.48,17.95 73.34,17.81
FETG13
  Top 0.813: Q7.1 87.31,17.81 | 87.31,17.81 R8.1 | Q10.3 87.45,17.95 87.31,17.81
FETG14
  Top 0.813: Q8.1 83.5,23.81 | 83.5,23.81 R9.1 | Q9.3 83.52,23.82 83.5,23.81
GND  (via drill 0.6)
  other vias: 38,52.31 40.5,50.81 21.5,43.81 21.5,50.81 54.5,40.31 58,35.31 56.5,47.31 10,74.81 8.5,74.81 81,24.31 74,21.31 67,71.31 68,70.31 3.5,21.31 87,37.47 87.95,37.47 88.9,37.47 89.85,37.47 90.81,37.47 87.95,38.42 88.9,38.42 89.85,38.42 90.81,38.42 88.27,46.67 89.22,46.67 90.17,46.67 92.39,43.18 93.03,43.82 93.66,44.45 93.64,43.18
  pour Top (isolate 0.305): 0,92.81 0,-0.19 100,-0.19 100.1,38.73 94.18,38.73 94.18,45.4 100.03,45.4 100.03,47.31 94.18,47.31 94.18,58.42 100,58.17 100,92.56
  pour Bottom (isolate 0.305): 0,-0.19 0,92.81 101.5,92.81 101.5,-0.19
MISO  (via drill 0.6)
  Top 0.406: 64.77,38.42 64.21,38.17 IC2.16
  Top 0.813: U$1.7 27.4,54.07 27.94,54.61 27.94,60.64 28.89,61.59 52.72,61.59 v62.5,51.81 | 67.31,38.42 67.31,48.26 65.5,50.07 v65.5,51.81 | 67.31,38.42 64.77,38.42 | U1.50 70.17,33.02 67.31,35.88 67.31,38.42
  Bottom 0.813: v65.5,51.81 v62.5,51.81
MOSI
  Top 0.305: 73.34,31.75 71.12,31.75
  Top 0.406: U1.51 73.66,31.75 73.34,31.75 | 65.09,37.15 64.71,37.52 IC2.15
  Top 0.813: 71.12,31.75 66.04,31.75 | 66.04,31.75 66.04,36.2 65.09,37.15 | IC3.5 43.88,52.32 47.94,48.26 47.94,35.24 51.44,31.75 66.04,31.75
N$1
  Top 0.406: Y1.1 51.94,38.17 IC2.5
N$2
  Top 0.813: U1.RESET 8.16,26.13 RESET.P$1
N$3
  Top 0.406: Y1.2 52.02,39.47 IC2.3
N$4
  Top 0.813: A8.1 2.54,10.79 Q1.3
N$5
  Bottom 0.406: A8.2 8.89,8.7 12.5,12.31 12.5,13.81 19,20.81 50.02,20.81 U1.A8
N$6
  Top 0.813: A9.1 16.51,10.79 Q2.3
N$7
  Bottom 0.406: A9.2 22.86,9.17 26.5,12.81 26.5,18.31 28,19.81 51.56,19.81 U1.A9
N$8
  Top 0.813: A10.1 30.48,10.79 Q3.3
N$9
  Top 0.813: A15.1 92.08,22.86 Q8.3
N$10
  Top 0.813: A14.1 86.36,10.79 Q7.3
N$11
  Top 0.813: A13.1 72.39,10.79 Q6.3
N$12
  Top 0.813: A12.1 58.42,10.79 Q5.3
N$13
  Top 0.813: A11.1 44.45,10.79 Q4.3
N$14  (via drill 0.6)
  Top 0.406: v62,66.31 62,60.31 v59,57.31 | v49.21,57.15 49.21,38.62 50.96,36.87 51.86,36.87 | IC2.7 51.86,36.87 | R1.1 51.86,36.87
  Bottom 0.406: U1.20 62.23,66.54 v62,66.31 | v59,57.31 49.37,57.31 v49.21,57.15
N$15  (via drill 0.6)
  Top 0.406: IC2.2 57.58,40.12 57.78,40.32 58.1,40.64 58.1,41.91 54.61,45.4 54.61,53.98 48.26,60.33 30.16,60.33 29.21,59.37 29.21,53.66 v27.94,52.39
  Bottom 0.813: v27.94,52.39 19.37,52.39 | 19.37,52.39 19.37,34.92 18.1,33.66 BATT1.V1 | 19.37,52.39 19.37,56.2 17.78,57.79 BATT1.V2
N$16
  Top 0.813: R2.2 Q1.2 1.59,16.2 1.27,15.88 1.27,6.98 2.54,5.71 5.71,5.71 6.99,6.98 6.99,10.79 8.89,12.7 JP-A8.2
N$17
  Bottom 0.406: A10.2 40.5,11.93 40.5,18.31 41,18.81 53.1,18.81 U1.A10
N$18
  Bottom 0.406: A11.2 54.5,11.96 54.5,17.67 U1.A11
N$19
  Top 0.813: R3.2 Q3.2 29.53,16.2 29.21,15.88 29.21,6.98 30.48,5.71 33.66,5.71 34.92,6.98 34.92,10.79 36.83,12.7 JP-A10.2
N$20
  Bottom 0.406: A12.2 68.5,11.99 68.5,16.81 66,19.31 64,19.31 62.23,21.08 U1.A12
N$21
  Top 0.813: R9.2 Q8.2 85.41,21.91 85.72,21.59 94.61,21.59 95.89,22.86 95.89,24.76 94.61,26.04 92.08,26.04 88.9,29.21 JP-A15.2
N$22
  Top 0.813: R8.2 Q7.2 85.41,16.2 85.09,15.88 85.09,6.98 86.36,5.71 89.53,5.71 90.81,6.98 90.81,10.79 92.71,12.7 JP-A14.2
N$23
  Top 0.813: R7.2 Q6.2 71.44,16.2 71.12,15.88 71.12,6.98 72.39,5.71 75.56,5.71 76.83,6.98 76.83,10.79 78.74,12.7 JP-A13.2
N$24
  Top 0.813: R6.2 Q5.2 57.47,16.2 57.15,15.88 57.15,6.98 58.42,5.71 61.59,5.71 62.87,6.98 62.87,10.79 64.77,12.7 JP-A12.2
N$25
  Top 0.813: R4.2 Q4.2 43.5,16.2 43.18,15.88 43.18,6.98 44.45,5.71 47.62,5.71 48.9,6.98 48.9,10.79 50.8,12.7 JP-A11.2
N$26
  Top 0.813: R10.2 Q2.2 15.24,15.92 15.24,6.98 16.51,5.71 19.68,5.71 20.95,6.98 20.95,10.79 22.86,12.7 JP-A9.2
N$27
  Top 0.813: R13.2 77.96,20.15 Q11.1
N$28
  Top 0.813: R14.2 63.99,20.15 Q12.1
N$29
  Top 0.813: R15.2 50.02,20.15 Q13.1
N$30
  Bottom 0.406: A13.2 82.5,12.02 82.5,16.81 81,18.31 69.32,18.31 U1.A13
N$31
  Top 0.813: R16.2 36.05,20.15 Q14.1
N$32
  Top 0.813: R17.2 22.08,20.15 Q15.1
N$33
  Top 0.813: R18.2 8.11,20.15 Q16.1
N$34
  Top 0.813: R11.1 82.55,29.49 Q9.1
N$35
  Top 0.813: R12.2 92.01,20.07 91.2,20.07 Q10.1
N$36
  Top 0.813: U1.47 80.33,32.7 R11.2
N$37
  Top 0.254: U1.46 73.62,39.34 73.62,41.19 74.38,41.94 76,41.94
  Top 0.406: 76,41.94 84,33.81 84,31.43 85.12,30.31 90.5,30.31 91,29.81 95.5,29.81 97,28.31 97,20.31 95.74,19.05 R12.1
N$38  (via drill 0.6)
  Top 0.406: U1.45 80,35.57 v80,34.81 | v80,31.31 80,21.31 80.96,20.35 R13.1
  Bottom 0.406: v80,34.81 v80,31.31
N$39  (via drill 0.6)
  Top 0.406: v73.62,24.93 73.62,23.93 68.74,19.05 R14.1
  Bottom 0.254: U1.44 73.62,39.41 v73.62,24.93
N$40  (via drill 0.6)
  Top 0.813: R15.1 53.02,20.29 52.5,20.81 51.5,20.81 49.5,22.81 v49.5,27.81
  Bottom 0.305: 70.5,41.81 71,41.81 71.12,41.94 73.62,41.94 74.87,43.18 U1.43
  Bottom 0.813: v49.5,27.81 49.5,40.31 51,41.81 70.5,41.81
N$41  (via drill 0.6)
  Top 0.305: R16.1 39,19.1 39,20.31 38,21.31 28,21.31 27.25,22.06 v27.25,22.68
  Bottom 0.813: U1.42 44.12,43.18 27.25,26.31 v27.25,22.68
N$42  (via drill 0.6)
  Top 0.813: R17.1 26,19.97 v26,21.81
  Bottom 0.305: 70.5,44.31 71,44.31 71.12,44.44 73.62,44.44 74.91,45.72 U1.41
  Bottom 0.813: 70.5,44.31 43.5,44.31 26,26.81 v26,21.81
N$43  (via drill 0.6)
  Top 0.254: 12.75,20.69 12.75,24.06
  Top 0.305: R18.1 12.75,20.69 | 12.75,24.06 13.5,24.81
  Top 0.813: 13.5,24.81 21,32.31 v29.5,32.31
  Bottom 0.813: v29.5,32.31 42.91,45.72 U1.40
N$44  (via drill 1, 1.3)
  Top 0.406: v95.25,71.17 93.28,71.17 v93.25,71.14
  Top 0.813: v95.28,69.17 v95.25,71.17 | v95.22,73.17 v95.25,71.17 | v97.25,71.14 v95.25,71.17 | v70.75,88.81 69.25,88.81 v70.75,87.31 v70.75,88.81 | v72.5,90.31 72.25,88.81 v70.75,88.81 | v70.75,90.31 v70.75,88.81
  Top 5.08: v87.95,79.92 v87.95,84.39 v87.92,82.14 83.86,82.14 FS1.2 | 70.38,88.77 65.66,88.77 64.21,88.77 64,88.56 62.73,87.29 X1.3 | 70.38,88.77 71.27,89.66 | 70.38,88.77 70.42,88.81 v70.75,88.81
  Top 6.452: FS2.1 v95.25,71.17
  Bottom 5.08: 79.76,89.15 79.12,89.79 70.12,89.79 70.75,89.16 v70.75,88.81
  Bottom 6.452: v95.25,71.17 87.95,78.47 v87.95,84.39 83.5,88.58 83.23,88.58 83,88.81 82.66,89.15 79.76,89.15
N$45
  Top 0.406: X1.1 73.22,83.78 73.7,84.26
  Top 5.08: 79.25,89.81 73.7,84.26
  Top 5.25: FS2.2 95.25,88.06 93,89.81 79.25,89.81
N$46  (via drill 0.6)
  Top 0.813: v49.53,81.28 46.35,81.28 43.81,83.82 SER1.3
  Bottom 0.813: U1.18 57.15,74.3 50.16,81.28 v49.53,81.28
N$47
  Bottom 0.813: U1.19 59.69,75.56 53.98,81.6 53.98,84.14 51.75,86.36 49.53,86.36 SER1.2
N$48  (via drill 0.6)
  Top 0.813: v42.23,81.28 43.81,81.28 45.09,80.01 47.31,80.01 47.31,80 v48,79.31
  Bottom 0.813: 42.86,81.28 v42.23,81.28 31.75,81.28 SER2.2 | U1.17 48,77.73 v48,79.31
N$49
  Bottom 0.813: SER2.3 29.53,79.69 35.56,79.69 40.01,75.25 47.94,75.25 U1.16
N$50
  Bottom 0.813: U1.15 49.97,70.67 SJ2.2 49.97,65.53 48.9,64.45 26.67,64.45 21.91,69.22 21.91,73.03 18.73,76.2 SER3.2
N$51
  Bottom 0.813: SJ1.2 46.16,70.29 U1.14 44.77,73.34 23.5,73.34 16.83,80.33 16.83,85.73 16.19,86.04 9.84,86.04 SER3.3
N$52
  Top 0.813: R19.2 91,58.55 LED1.C
N$53
  Top 0.813: SER1.1 50.8,79.47 Q17.3
N$54
  Top 0.813: SER2.1 33.02,78.97 Q18.3
N$55
  Top 0.813: SER3.1 15.24,78.97 Q19.3
N$56
  Top 0.813: Q17.1 50.85,75.81 | 50.85,75.81 R20.2 | Q22.3 50.77,75.89 50.85,75.81
N$57
  Top 0.813: R21.2 32.57,75.81 | 32.57,75.81 Q18.1 | Q21.3 32.48,75.89 32.57,75.81
N$58
  Top 0.813: Q19.1 14.79,75.81 | 14.79,75.81 R22.2 | Q20.3 14.71,75.89 14.79,75.81
N$59
  Top 0.813: Q17.2 R20.1 | JP-S1.2 43.18,78.74 40.96,80.96 40.96,84.77 42.55,86.36 51.44,86.36 52.7,85.09 52.72,85.09 53,84.81 53,76.72 Q17.2 | 52.7,76.52 Q17.2
N$60
  Top 0.813: R21.1 Q18.2 33.97,76.52 34.92,77.47 34.92,85.09 33.66,86.36 28.57,86.36 27.3,85.09 27.3,82.55 24.77,80.01 JP-S2.2
N$61
  Top 0.813: R22.1 Q19.2 17.14,76.92 17.14,85.09 15.88,86.36 10.79,86.36 9.53,85.09 9.53,81.92 7.62,80.01 JP-S3.2
N$65
  Top 0.813: Q20.1 7.26,73.7 R26.1
N$67
  Top 0.406: R26.2 4.75,74.31 1.5,74.31 0.5,73.31 0.5,69.81 1,69.31 22.5,69.31 24.5,67.31 69,67.31 70.27,66.04 U1.24
N$68
  Top 0.813: R27.1 27.89,74.3 Q21.1
N$69
  Top 0.254: 71.5,67.31 73.5,67.31
  Top 0.406: R27.2 22,74.2 22,73.31 22.5,72.81 22.5,70.81 25,68.31 70,68.31 71,67.31 71.5,67.31 | 73.5,67.31 74,67.31 74.93,68.24 U1.23
N$70
  Top 0.813: R28.1 41.6,74.31 46.66,74.31 Q22.1
N$71
  Top 0.406: U1.22 72.23,68.58 71.5,69.31 46,69.31 42.5,72.81 40.5,72.81 39.69,73.62 R28.2
N$72
  Top 0.406: U2.7 88.7,50.27 C10.1
N$73
  Bottom 0.813: SJ2.1 39.05,66.36 35.95,66.36 34.5,67.81 34.29,68.02 U1.3
N$74  (via drill 0.6)
  Top 0.406: U2.6 89.35,49.03 v89.85,49.53 | v83.19,43.5 83.19,41.98 R29.1
  Bottom 0.406: v89.85,49.53 84.14,49.53 83.19,48.58 v83.19,43.5
N$75
  Top 0.406: U2.1 88.05,45.19 87.31,44.45 87,44.45 86.76,44.21 C11.1
N$77
  Bottom 0.813: SJ1.1 38.05,68.26 37,69.31 36.83,69.48 U1.2
N$78
  Top 0.406: U2.8 88.05,48.79 87.63,49.21 87.37,49.47 R30.2
N$79
  Top 0.406: R32.1 89.2,53.61 C5.1 | R30.1 84.45,52.89 C5.1 | R31.1 84.45,52.77 C5.1
N$80  (via drill 0.6)
  Top 0.406: U2.3 89.35,44.63 89.85,44.13 v90.49,44.13
  Top 0.813: v91.12,44.77 v90.49,44.13 v90.49,43.18
  Bottom 2.54: v97.16,51.12 96.84,51.12 96.84,50.48 v90.49,44.13
  other vias: 96.2,51.12 98.11,51.12
  pour Top (isolate 0.305): 100.03,48.01 100.03,57.58 94.89,57.58 94.89,48.01
N$82  (via drill 0.6)
  Top 0.406: U2.5 90.58,48.04 v90.81,48.26 | v94.3,52.71 94.36,52.77 R33.2
  Bottom 0.406: v90.81,48.26 92.08,48.26 93.98,50.16 94.3,50.48 v94.3,52.71
N$83
  Top 0.406: R33.1 94.49,56.01 C12.1
N$87
  Bottom 0.406: A14.2 92.71,10.02 96.5,13.81 96.5,16.81 94,19.31 70.86,19.31 U1.A14
N$88
  Bottom 0.406: 92.87,27.94 A15.2 90.17,27.94 87.63,30.48 84.45,30.48 83.5,29.52 83.5,29.09 83.5,21.31 82.5,20.31 72.4,20.31 U1.A15
RTC_CS  (via drill 0.6)
  Top 0.406: v63.63,34.29 63.82,34.48 63.82,35.24 63.49,35.57 IC2.12
  Bottom 0.813: U1.48 71.12,34.29 v63.63,34.29
SCK  (via drill 0.6)
  Top 0.406: IC2.14 63.78,36.87 64.45,36.2 v64.45,33.02
  Top 0.813: U1.52 v64.45,30.48 50.8,30.48 46.67,34.61 46.67,45.4 43.56,48.51 IC3.2
  Bottom 0.406: v64.45,33.02 v64.45,30.48
SD_CS
  Top 0.813: U1.49 75.56,35.56 76.83,34.29 76.83,26.67 76.2,26.04 53.34,26.04 45.4,33.97 45.4,41.28 39.37,47.31 39.37,53.66 | 39.37,53.66 39.37,56.32 R5.2 | IC3.9 39.31,53.59 39.37,53.66
SD_CSIN
  Top 0.813: U$1.1 26.06,39.07 33.66,46.67 33.66,53.98 34.54,54.86 IC3.8
SD_DATAIN
  Top 0.813: IC3.6 44.07,53.59 45.09,54.61 45.09,57.79 43.81,59.05 33.34,59.05 32.38,57.79 32.38,47.31 26.33,41.57 U$1.2
SD_SCKIN  (via drill 0.6)
  Top 0.813: U$1.5 26.85,49.07 v27.3,49.53 | v44.45,49.53 44.2,49.78 IC3.3
  Bottom 0.813: v27.3,49.53 v44.45,49.53
(copper drawn outside any net)
  shapes: Top area x3

### Text on the board
tNames: G I3O + | G I2O + | G I1O + | G + | G + | 4A | 1A | BATT SOLAR | v1.5 April 2016 | + 15 G | + 8 G | + 9 G | + 10 G | + 11 G | + 12 G | + 13 G | + 14 G
bNames: UBCEcoHydro / Arduino Mega Shield